# Altium schematic sheet RS-485.SchDoc
size A4; SheetNumber: 11; SheetTotal: 12
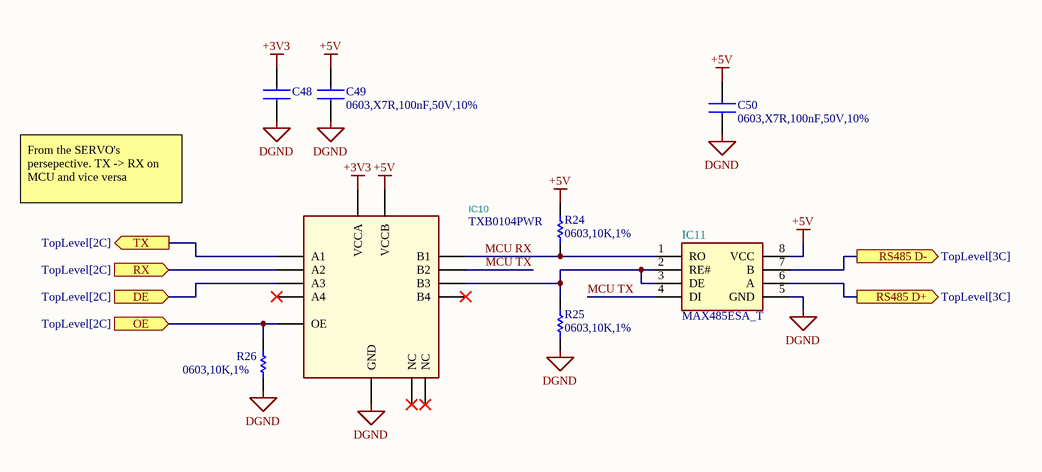
[diagram p0: RS-485.SchDoc]

## Parts
C48  0603,X7R,100nF,50V,10%  [CAPC1608X90N]  (value not drawn)
C49  0603,X7R,100nF,50V,10%  [CAPC1608X90N]
C50  0603,X7R,100nF,50V,10%  [CAPC1608X90N]
IC10  TXB0104PWR  [TXB0104PWR]
IC11  MAX485ESA_T  [MAX485ESA_T]
R24  0603,10K,1%  [RESC1608X55N]
R25  0603,10K,1%  [RESC1608X55N]
R26  0603,10K,1%  [RESC1608X55N]

## Ports
DE (in, see TopLevel[2C]), OE (in, see TopLevel[2C]), RS485 D+ (out, see TopLevel[3C]), RS485 D- (out, see TopLevel[3C]), RX (in, see TopLevel[2C]), TX (out, see TopLevel[2C])

## Nets
+3V3: C48.2 IC10.1(VCCA)
+5V: C49.2 C50.2 IC10.14(VCCB) IC11.8(VCC) R24.2
DGND: C48.1 C49.1 C50.1 IC10.7(GND) IC11.5(GND) R25.1 R26.1
DE: IC10.4(A3) ; port DE
MCU RX: IC10.13(B1) IC11.1(RO) R24.1
MCU TX: IC10.12(B2) IC11.4(DI)
OE: IC10.8(OE) R26.2 ; port OE
RS485 D+: IC11.6(A) ; port RS485 D+
RS485 D-: IC11.7(B) ; port RS485 D-
RX: IC10.3(A2) ; port RX
TX: IC10.2(A1) ; port TX
NetIC10_11: IC10.11(B3) IC11.2(RE#) IC11.3(DE) R25.2

Not connected (* = marked no-connect by the designer): IC10 5(A4)* 6(NC)* 9(NC)* 10(B4)*

## Notes on the sheet
- From the SERVO's persepective. TX -> RX on MCU and vice versa

## Library data of the parts
C48-C50 = CC0603KRX7R9BB104: 50V 100nF X7R ±10% 0603 Multilayer Ceramic Capacitors MLCC - SMD/SMT ROHS; LCSC Part #: C14663; Manu Part #: CC0603KRX7R9BB104
IC10 = TXB0104PWR: -40℃~+85℃ 1 1.2V~3.6V 1.65V~5.5V 100Mbps 4 Auto Direction Detection Bidirectional CMOS CMOS Tri-State TSSOP-14 Translators, Level Shifters ROHS; Manufacturer: Texas Instruments; ki_keywords: C60708 TSSOP-14_L5.0-W4.4-P0.65-LS6.4-BL TXB0104PWR Texas Instruments; Footprint: JLCImport:TXB0104PWR; Datasheet: https://www.lcsc.com/datasheet/lcsc_datasheet_1810151620_Texas-Instruments-TXB0104PWR_C60708.pdf; Description_: -40℃~+85℃ 1 1.2V~3.6V 1.65V~5.5V 100Mbps 4 Auto Direction Detection Bidirectional CMOS CMOS Tri-State TSSOP-14 Translators, Level Shifters ROHS; LCSC Part #: C60708; Manu Part #: TXB0104PWR
IC11 = MAX485ESA_T: -40℃~+85℃ 1 1 2.5Mbps 4.75V~5.25V Transceiver SOIC-8 RS-485 / RS-422 ICs ROHS; Manu Part #: MAX485ESA+T; LCSC Part #: C19738
R24-R26 = RC0603FR-0710KL: 100mW Thick Film Resistor 75V ±100ppm/℃ ±1% 10kΩ 0603 Chip Resistor - Surface Mount ROHS; LCSC Part #: C98220; Manu Part #: RC0603FR-0710KL